# Altium schematic sheet A5_sub_interface.SchDoc
size A4; SheetNumber: 5; SheetTotal: 6
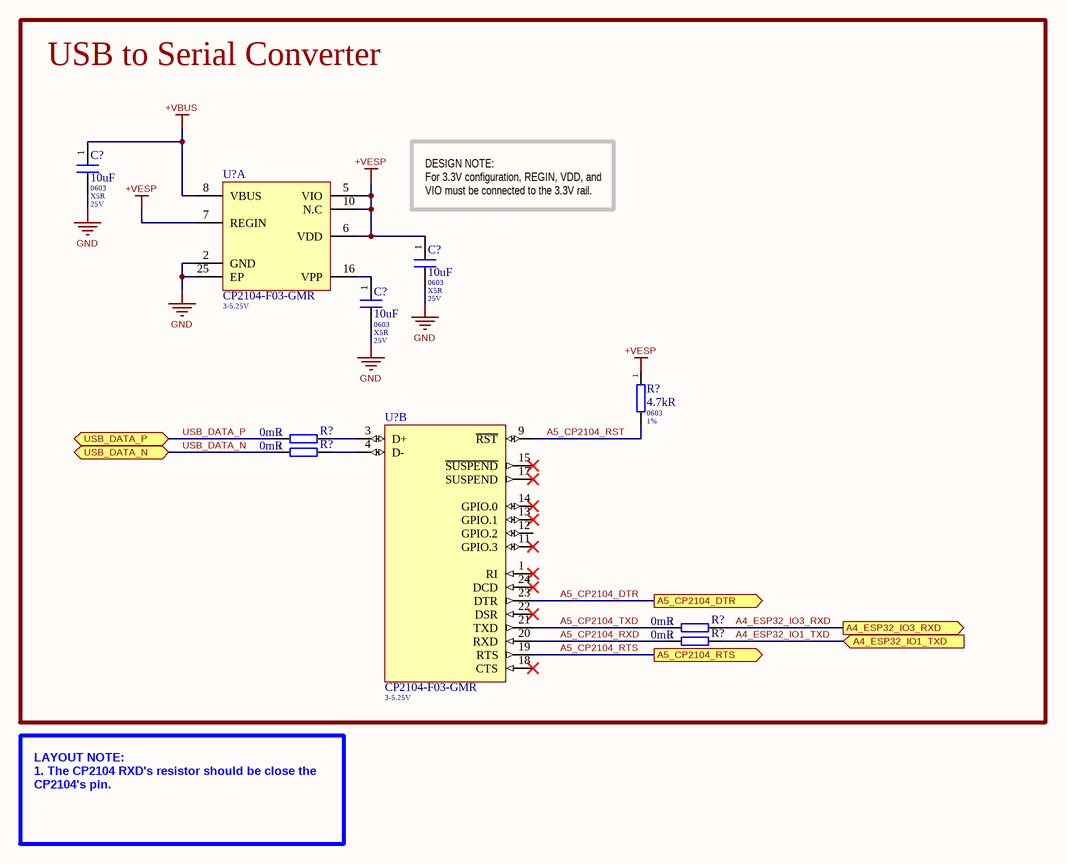
[diagram p0: A5_sub_interface.SchDoc]

## Parts
(Parts that share a designator on the sheet are numbered #1, #2 ... from top to bottom, then left to right.)
C?#1  Capacitance: 10uF  Case Code (Imperial): 0603  Dielectric: X5R  Voltage: 25V  [CAPC1608X10N]  (hidden comment: CAP-CER_10u_25V_20%_X5R_0603)
C?#2  Capacitance: 10uF  Case Code (Imperial): 0603  Dielectric: X5R  Voltage: 25V  [CAPC1608X10N]  (hidden comment: CAP-CER_10u_25V_20%_X5R_0603)
C?#3  Capacitance: 10uF  Case Code (Imperial): 0603  Dielectric: X5R  Voltage: 25V  [CAPC1608X10N]  (hidden comment: CAP-CER_10u_25V_20%_X5R_0603)
R?#1  value 4.7kR  Case/Package: 0603  Tolerance: 1%  [RESC1608X06N]  (hidden comment: RES_4.7K_100mW_1%_0603)
R?#2  Resistance: 0mR  [RESC1608X06N]  (hidden comment: RES_0R_100mW_1%_0603)
R?#3  Resistance: 0mR  [RESC1608X06N]  (hidden comment: RES_0R_100mW_1%_0603)
R?#4  Resistance: 0mR  [RESC1608X06N]  (hidden comment: RES_0R_100mW_1%_0603)
R?#5  Resistance: 0mR  [RESC1608X06N]  (hidden comment: RES_0R_100mW_1%_0603)
U?#1  MFG PN: CP2104-F03-GMR  Voltage Range: 3-5.25V  [QFN50P400X400X80_HS-25N]  (hidden comment: IC_USB-SERIAL_CP2104-F03-GMR_3-5.25Vin_2Mbit_QFN-24)  (part A of 2)
U?#2  MFG PN: CP2104-F03-GMR  Voltage Range: 3-5.25V  [QFN50P400X400X80_HS-25N]  (hidden comment: IC_USB-SERIAL_CP2104-F03-GMR_3-5.25Vin_2Mbit_QFN-24)  (part B of 2)

## Blocks framed on the sheet
USB to Serial Converter: C?#1-C?#3 R?#1-R?#5 U?#1 U?#2

## Ports
A4_ESP32_IO1_TXD (in), A4_ESP32_IO3_RXD (out), A5_CP2104_DTR (out), A5_CP2104_RTS (out), USB_DATA_N (bidir), USB_DATA_P (bidir)

## Nets
+VBUS: C?#1.1 U?#1.8(VBUS)
+VESP: C?#2.1 R?#1.1 U?#1.5(VIO) U?#1.6(VDD) U?#1.7(REGIN) U?#1.10(N.C)
GND: C?#1.2 C?#2.2 C?#3.2 U?#1.2(GND) U?#1.25(EP)
A4_ESP32_IO1_TXD: R?#5.2 ; port A4_ESP32_IO1_TXD
A4_ESP32_IO3_RXD: R?#4.2 ; port A4_ESP32_IO3_RXD
A5_CP2104_DTR: U?#2.23(DTR) ; port A5_CP2104_DTR
A5_CP2104_RST: R?#1.2 U?#2.9(~{RST})
A5_CP2104_RTS: U?#2.19(RTS) ; port A5_CP2104_RTS
A5_CP2104_RXD: R?#5.1 U?#2.20(RXD)
A5_CP2104_TXD: R?#4.1 U?#2.21(TXD)
USB_DATA_N: R?#3.1 ; port USB_DATA_N
USB_DATA_P: R?#2.1 ; port USB_DATA_P
NetC?#3_1: C?#3.1 U?#1.16(VPP)
NetR?#2_2: R?#2.2 U?#2.3(D+)
NetR?#3_2: R?#3.2 U?#2.4(D-)

Not connected (* = marked no-connect by the designer): U?#2 1(RI)* 11(GPIO.3)* 12(GPIO.2) 13(GPIO.1)* 14(GPIO.0)* 15(~{SUSPEND})* 17(SUSPEND)* 18(CTS)* 22(DSR)* 24(DCD)*

## Notes on the sheet
- DESIGN NOTE:
  For 3.3V configuration, REGIN, VDD, and VIO must be connected to the 3.3V rail.
- LAYOUT NOTE:
  1. The CP2104 RXD's resistor should be close the CP2104's pin.

## Library data of the parts
C?#1-C?#3 = Samsung_CL10A106MA8NRNC: Material: 4241ConductorMaterial; Value: 10uF; Tolerance: 20%; _Checked_PCB: N.A; _Checked_SCH: HoP; Supplier: Mouser; Supplier Part Number: 187-CL10A106MA8NRNC; MFG: Samsung; MFG PN: CL10A106MA8NRNC; RoHS: Yes; Category: Ceramic Capacitors; Stock: 259799; Pricing: 1=0.14, 10=0.086, 50=0.086, 100=0.058, 1000=0.046, 10000=0.037 (USD); Mounting Technology: Surface Mount; Case/Package: 0603; Case Code (Metric): 1608; Min Operating Temperature: -55°C; Max Operating Temperature: 85°C; Packaging: Cut Tape; Voltage Rating: 25V; Series: CL; Height: 900um; RoHS Compliant: Yes; Lead Free: 5697LeadFree; ComponentLink1URL: https://datasheet.ciiva.com/25766/cl10a106ma8nrnc-25766562.pdf?src-supplier=Digikey; ComponentLink1Description: https://datasheet.ciiva.com/25766/cl10a106ma8nrnc-25766562.pdf?src-supplier=Digikey; _Creator: HoP; _SYM_REF: CAP-CER_10u_25V_20%_X5R_0603
R?#1 = Yageo_RC0603FR-074K7L: MFG: Yageo; Power Rating: 100mW; Voltage Rating (DC): 50V; Temperature Coefficient: 100ppm/°C; _Checked_PCB: N.A; _Checked_SCH: HoP; _Value: 4700; Supplier: Digikey; Supplier Part Number: 311-4.70KHRCT-ND; MFG PN: RC0603FR-074K7L; RoHS: Yes; Category: Chip SMD Resistors; Stock: 1531710; Pricing: 1=0.1, 10=0.009, 100=0.0082, 1000=0.0051 (USD); Pins: 2; Case Code (Imperial): 0603; Case Code (Metric): 1608; Min Operating Temperature: -55°C; Max Operating Temperature: 155°C; Resistor Type: Thick Film; Packaging: Tape and Reel; Voltage Rating: 50V; Termination: SMD/SMT; Features: Moisture Resistant; Series: RC; Max Power Dissipation: 100mW; Number of Terminations: 2; Construction: Rectangular; Resistance Tolerance: 1%; Length: 1.6mm; Width: 0.8mm; Depth: 0.8mm; Lead Pitch: 0.3mm; Reach SVHC Compliant: Unknown; Lead Free: 5697LeadFree; Military Standard: Not; RoHS Compliant: Yes; ComponentLink1URL: https://datasheet.ciiva.com/15189/getdatasheetpartid-422754-15189760.pdf?src-supplier=Verical; ComponentLink1Description: https://datasheet.ciiva.com/15189/getdatasheetpartid-422754-15189760.pdf?src-supplier=Verical; ComponentLink2URL: https://datasheet.ciiva.com/46440/1868787-46440909.pdf?src-supplier=Element14; ComponentLink2Description: https://datasheet.ciiva.com/46440/1868787-46440909.pdf?src-supplier=Element14; ComponentLink3URL: https://datasheet.ciiva.com/7660/38590-7660794.pdf?src-supplier=Element14; ComponentLink3Description: https://datasheet.ciiva.com/7660/38590-7660794.pdf?src-supplier=Element14; ComponentLink4URL: https://datasheet.ciiva.com/22747/443971-22747528.pdf?src-supplier=Element14; ComponentLink4Description: https://datasheet.ciiva.com/22747/443971-22747528.pdf?src-supplier=Element14; ComponentLink5URL: https://datasheet.ciiva.com/7746/1868787-7746365.pdf?src-supplier=Element14; ComponentLink5Description: https://datasheet.ciiva.com/7746/1868787-7746365.pdf?src-supplier=Element14; ComponentLink6URL: https://datasheet.ciiva.com/7746/1738695-7746366.pdf?src-supplier=Element14; ComponentLink6Description: https://datasheet.ciiva.com/7746/1738695-7746366.pdf?src-supplier=Element14; _Creator: HoP; _SYM_REF: RES_4.7K_100mW_1%_0603
R?#2-R?#5 = Yageo_RC0603FR-070RL: MFG: Yageo; Power Rating: 100mW; Voltage Rating (DC): 50V; Temperature Coefficient: 200ppm/°C; Resistance Tolerance: 1%; _Checked_PCB: HoP; _Value: 0; Supplier 1: Mouser; MFG PN: RC0603FR-070RL; RoHS: Yes; Category: Chip SMD Resistors; Stock 1: 3348927; Pricing 1: 1=0.1, 10=0.01, 50=0.01, 100=0.005, 1000=0.004, 10000=0.003 (USD); Number of Pins: 2; Contact Plating: Tin,Matte; Case Code (Metric): 1608; Case Code (Imperial): 0603; Min Operating Temperature: -55°C; Max Operating Temperature: 155°C; Packaging: Tape and Reel; Resistor Type: Thick Film; Package Quantity: 5000; Voltage Rating: 50V; Number of Terminations: 2; Termination: SMD/SMT; Max Power Dissipation: 100mW; Features: Moisture Resistant; Series: RC; Construction: Rectangular; Technology: THICK FILM; Length: 1.6mm; Width: 0.8mm; Height: 0.45mm; Depth: 0.8mm; Reach SVHC Compliant: No; Lead Free: Lead Free; RoHS Compliant: Yes; Military Standard: Not; ComponentLink1URL: https://datasheet.ciiva.com/11808/0900766b80f96399-11808172.pdf?src-supplier=Rs; ComponentLink1Description: https://datasheet.ciiva.com/11808/0900766b80f96399-11808172.pdf?src-supplier=Rs; ComponentLink2URL: https://datasheet.ciiva.com/5684/443971-5684699.pdf?src-supplier=Farnell; ComponentLink2Description: https://datasheet.ciiva.com/5684/443971-5684699.pdf?src-supplier=Farnell; ComponentLink3URL: https://datasheet.ciiva.com/7983/443971-7983627.pdf?src-supplier=Element14; ComponentLink3Description: https://datasheet.ciiva.com/7983/443971-7983627.pdf?src-supplier=Element14; ComponentLink4URL: https://datasheet.ciiva.com/22643/1868787-22643388.pdf?src-supplier=Element14; ComponentLink4Description: https://datasheet.ciiva.com/22643/1868787-22643388.pdf?src-supplier=Element14; ComponentLink5URL: https://datasheet.ciiva.com/46382/443971-46382072.pdf?src-supplier=Element14; ComponentLink5Description: https://datasheet.ciiva.com/46382/443971-46382072.pdf?src-supplier=Element14; ComponentLink6URL: https://datasheet.ciiva.com/29721/pyu-r-int-thick-7-29721178.pdf?src-supplier=Digi-Key; ComponentLink6Description: https://datasheet.ciiva.com/29721/pyu-r-int-thick-7-29721178.pdf?src-supplier=Digi-Key; ComponentLink7URL: https://datasheet.ciiva.com/29721/pyu-rc0603-51-rohs-l-4-29721179.pdf?src-supplier=Digi-Key; ComponentLink7Description: https://datasheet.ciiva.com/29721/pyu-rc0603-51-rohs-l-4-29721179.pdf?src-supplier=Digi-Key; ComponentLink8URL: https://datasheet.ciiva.com/5558/rc0603-272842-5558341.pdf?src-supplier=Mouser; ComponentLink8Description: https://datasheet.ciiva.com/5558/rc0603-272842-5558341.pdf?src-supplier=Mouser; Supplier Part Number 1: 603-RC0603FR-070RL; _Checked_SCH: HoP; _Creator: HoP; _SYM_REF: RES_0R_100mW_1%_0603; Case/Package: 0603; Tolerance: 1%
U?#1 U?#2 = Silabs_CP2104-F03-GMR: MFG: Silicon Labs; _Checked_PCB: N.A; _Checked_SCH: HoP; Supplier: Digikey; Supplier Part Number: 336-4146-6-ND; RoHS: Yes; Category: Interface ICs; Pricing: 1=4.96, 10=3.78, 25=3.484, 100=3.159, 250=3.00408, 500=2.91068 (USD); Height: 800um; ComponentLink1URL: https://datasheet.ciiva.com/14939/cp2104-14939979.pdf?src-supplier=Digikey; ComponentLink1Description: https://datasheet.ciiva.com/14939/cp2104-14939979.pdf?src-supplier=Digikey; ComponentLink2URL: https://datasheet.ciiva.com/15150/getdatasheetpartid-711722-15150533.pdf?src-supplier=Verical; ComponentLink2Description: https://datasheet.ciiva.com/15150/getdatasheetpartid-711722-15150533.pdf?src-supplier=Verical; _Creator: HoP; _SYM_REF: IC_USB-SERIAL_CP2104-F03-GMR_3-5.25Vin_2Mbit_QFN-24; Case/Package: QFN-24